# EAGLE design esp-boardlet (EAGLE 6.5.0)
CNAME: An ESP12 breakout board; CREVISION: 1; DESIGNER: Johan Kanflo
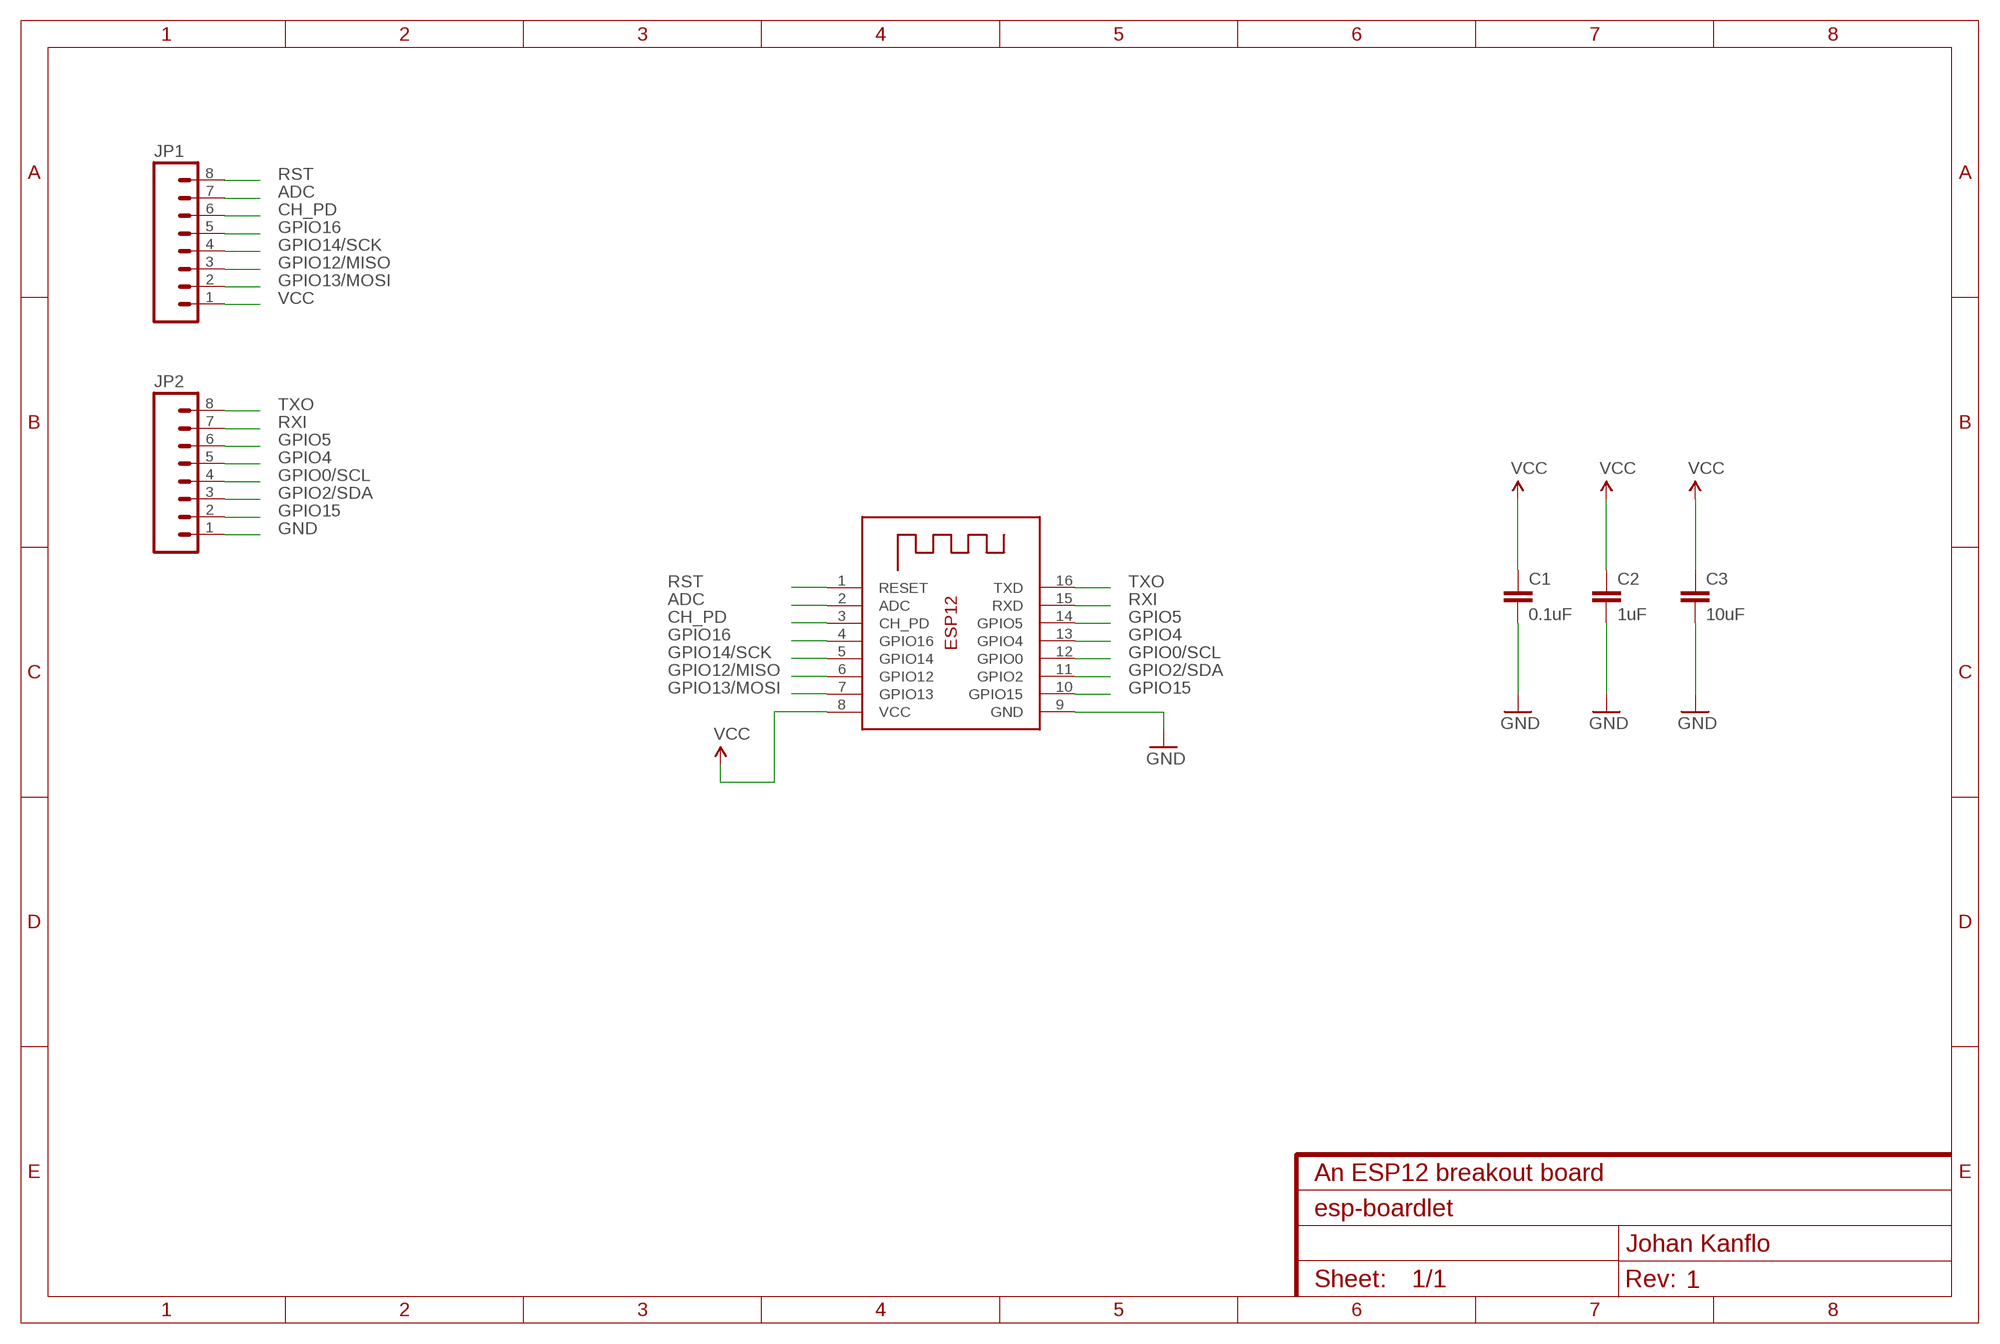
[diagram p0: schematic, sheet 1]

## Parts
C1  0.1uF  CAP0603-CAP  [0603-CAP]
C2  1uF  CAP0603-CAP  [0603-CAP]
C3  10uF  CAP0603-CAP  [0603-CAP]
JP1  M08  [1X08_ROUND]
JP2  M08  [1X08_ROUND]
X1  ESP-12  [ESP-12]

## Nets
ADC: JP1.7 X1.2(ADC)
CH_PD: JP1.6 X1.3(CH_PD)
GND: C1.2 C2.2 C3.2 JP2.1 X1.9(GND)
GPIO0/SCL: JP2.4 X1.12(GPIO0)
GPIO2/SDA: JP2.3 X1.11(GPIO2)
GPIO4: JP2.5 X1.13(GPIO4)
GPIO5: JP2.6 X1.14(GPIO5)
GPIO12/MISO: JP1.3 X1.6(GPIO12)
GPIO13/MOSI: JP1.2 X1.7(GPIO13)
GPIO14/SCK: JP1.4 X1.5(GPIO14)
GPIO15: JP2.2 X1.10(GPIO15)
GPIO16: JP1.5 X1.4(GPIO16)
RST: JP1.8 X1.1(RESET)
RXI: JP2.7 X1.15(RXD)
TXO: JP2.8 X1.16(TXD)
VCC: C1.1 C2.1 C3.1 JP1.1 X1.8(VCC)

## Library data of the parts
C1-C3 = SparkFun-Capacitors:CAP: Capacitor Standard 0603 ceramic capacitor, and 0.1" leaded capacitor.
JP1 JP2 = SparkFun-Connectors:M08: Header 8 Standard 8-pin 0.1" header. Use with straight break away headers (SKU : PRT-00116), right angle break away headers (PRT-00553), swiss pins (PRT-00743), machine pins (PRT-00117), and female headers (PRT-00115).
X1 = adafruit:ESP-12

## Board
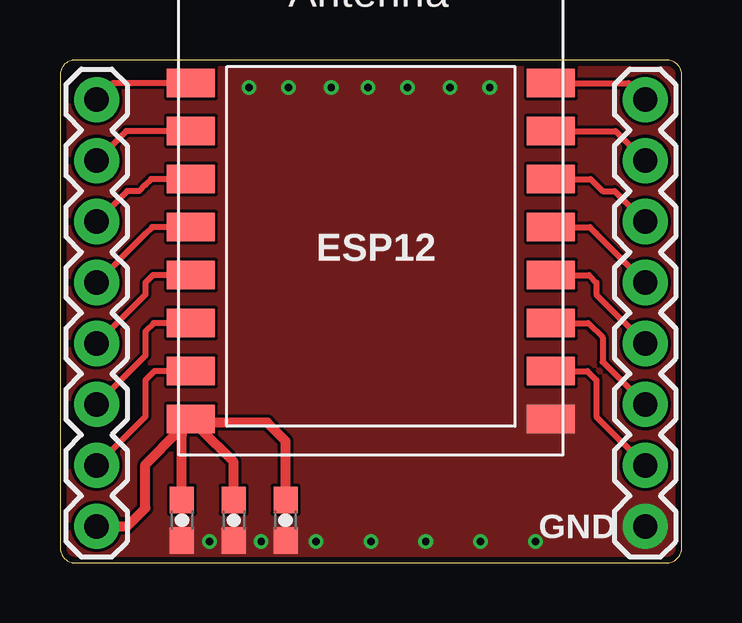
[diagram p1: board, top side]
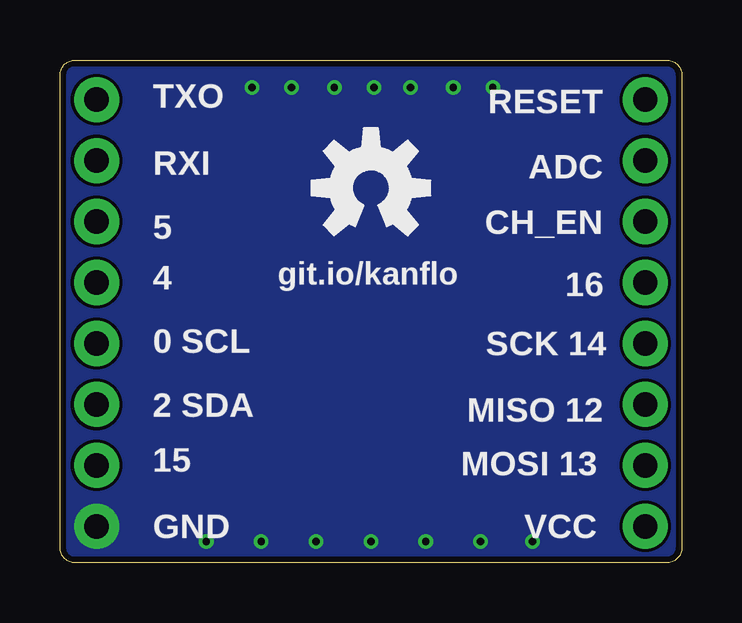
[diagram p2: board, bottom side, seen from below]

Size 25.91 x 20.95 mm. Coordinates in mm from the lower left corner, seen from the top.
Outline: 0,20.32 0,0.63 arc90 0.63,0 25.27,0 arc90 25.91,0.63 25.91,20.32 arc90 25.27,20.95 0.63,20.95 arc90 0,20.32
Copper layers (1*16): Top 0.035mm / dielectric 1.5mm / Bottom 0.035mm
Design rules "dirt_cheap_dirty_boards.v1": minimum track width 5mil, minimum drill 12mil, track to track 5mil, track to pad 5mil, pad to pad 5mil, via to via 5mil, smd to smd 0mil, copper to edge 10mil, drill to drill 10mil, minimum pad ring 10mil, minimum via ring 6mil, stop-mask expansion 2mil, vias tented up to drill 25mil, thermal gap 10mil

### Footprints (pad centres in the part's own frame; a part is rotated, then mirrored left to right if it is on the bottom)
0603-CAP = smd 1.1 x 1: 1 -0.85,0; 2 0.85,0
1X08_ROUND = drill 1.016 pad 1.88: 1 0,0; 2 2.54,0; 3 5.08,0; 4 7.62,0; 5 10.16,0; 6 12.7,0; 7 15.24,0; 8 17.78,0
ESP-12 = smd 2 x 1.2: 1 -7.5,4.5; 2 -7.5,2.5; 3 -7.5,0.5; 4 -7.5,-1.5; 5 -7.5,-3.5; 6 -7.5,-5.5; 7 -7.5,-7.5; 8 -7.5,-9.5; 9 7.5,-9.5; 10 7.5,-7.5; 11 7.5,-5.5; 12 7.5,-3.5; 13 7.5,-1.5; 14 7.5,0.5; 15 7.5,2.5; 16 7.5,4.5

### Placement (x,y rotation side)
C1  5.08,1.78 270 top
C2  7.24,1.78 270 top
C3  9.4,1.78 270 top
JP1  1.52,1.52 90 top
JP2  24.38,1.52 90 top
U$1  [OSHW-LOGO-M]  12.95,15.62 0 bottom
X1  12.95,15.49 0 top

### Tracks (layer width: path | path; a pad name or v marks a point on that pad's centre or on a via)
ADC
  Top 0.254: X1.2 2.75,17.99 JP1.7
CH_PD
  Top 0.254: X1.3 3.8,15.99 3.56,15.75 3.3,15.49 2.79,15.49 JP1.6
GND  (via drill 0.3 pad 0.25)
  other vias: 7.87,19.81 9.53,19.81 11.3,19.81 12.83,19.81 14.48,19.81 16.26,19.81 17.91,19.81 19.81,0.89 17.53,0.89 15.24,0.89 12.95,0.89 10.67,0.89 8.38,0.89 6.22,0.89
  pour Bottom (rank 6, no thermals): 0,20.95 25.91,20.95 25.91,0 0,0
  pour Top (rank 6, no thermals): 0,20.95 25.91,20.95 25.91,0 0,0
GPIO0/SCL
  Top 0.254: X1.12 22.04,11.99 22.35,11.68 22.35,11.18 JP2.4
GPIO2/SDA
  Top 0.254: X1.11 22.01,9.99 22.61,9.4 22.61,8.38 JP2.3
GPIO4
  Top 0.254: X1.13 22.07,13.99 22.35,13.72 JP2.5
GPIO5
  Top 0.254: X1.14 22.11,15.99 22.61,15.49 23.11,15.49 JP2.6
GPIO12/MISO
  Top 0.254: X1.6 3.9,9.99 3.56,9.65 3.56,8.64 JP1.3
GPIO13/MOSI
  Top 0.254: X1.7 3.93,7.99 3.56,7.62 3.56,6.1 JP1.2
GPIO14/SCK
  Top 0.254: X1.5 3.87,11.99 3.56,11.68 3.56,11.18 JP1.4
GPIO15
  Top 0.254: X1.10 21.98,7.99 22.35,7.62 22.35,6.1 JP2.2
GPIO16
  Top 0.254: X1.4 3.83,13.99 3.56,13.72 JP1.5
RST
  Top 0.254: X1.1 2.21,19.99 JP1.8
RXI
  Top 0.254: X1.15 23.15,17.99 JP2.7
TXO
  Top 0.254: X1.16 23.69,19.99 JP2.8
VCC
  Top 0.406: JP1.1 2.79,1.52 3.56,2.29 3.56,4.1 4.94,5.48 | 4.94,5.48 X1.8 5.85,5.6 | C1.1 5.08,5.33 4.94,5.48 | C2.1 7.24,4.21 5.85,5.6 | C3.1 9.4,5.08 8.64,5.84 6.1,5.84 5.85,5.6

### Text on the board
tNames: ESP12 | GND
bNames: RESET | TXO | ADC | RXI | CH_EN | 5 | 16 | git.io/kanflo | 4 | SCK 14 | 0 SCL | MISO 12 | 2 SDA | MOSI 13 | 15 | VCC | GND
Document: 0 SCL
Reference: RXI | 5
tDocu: RESET | TXO | ADC | CH_EN | 16 | 4 | SCK 14 | MISO 12 | 2 SDA | MOSI 13 | 15 | VCC | GND